# EAGLE design md_ver10.2 (EAGLE 6.4)
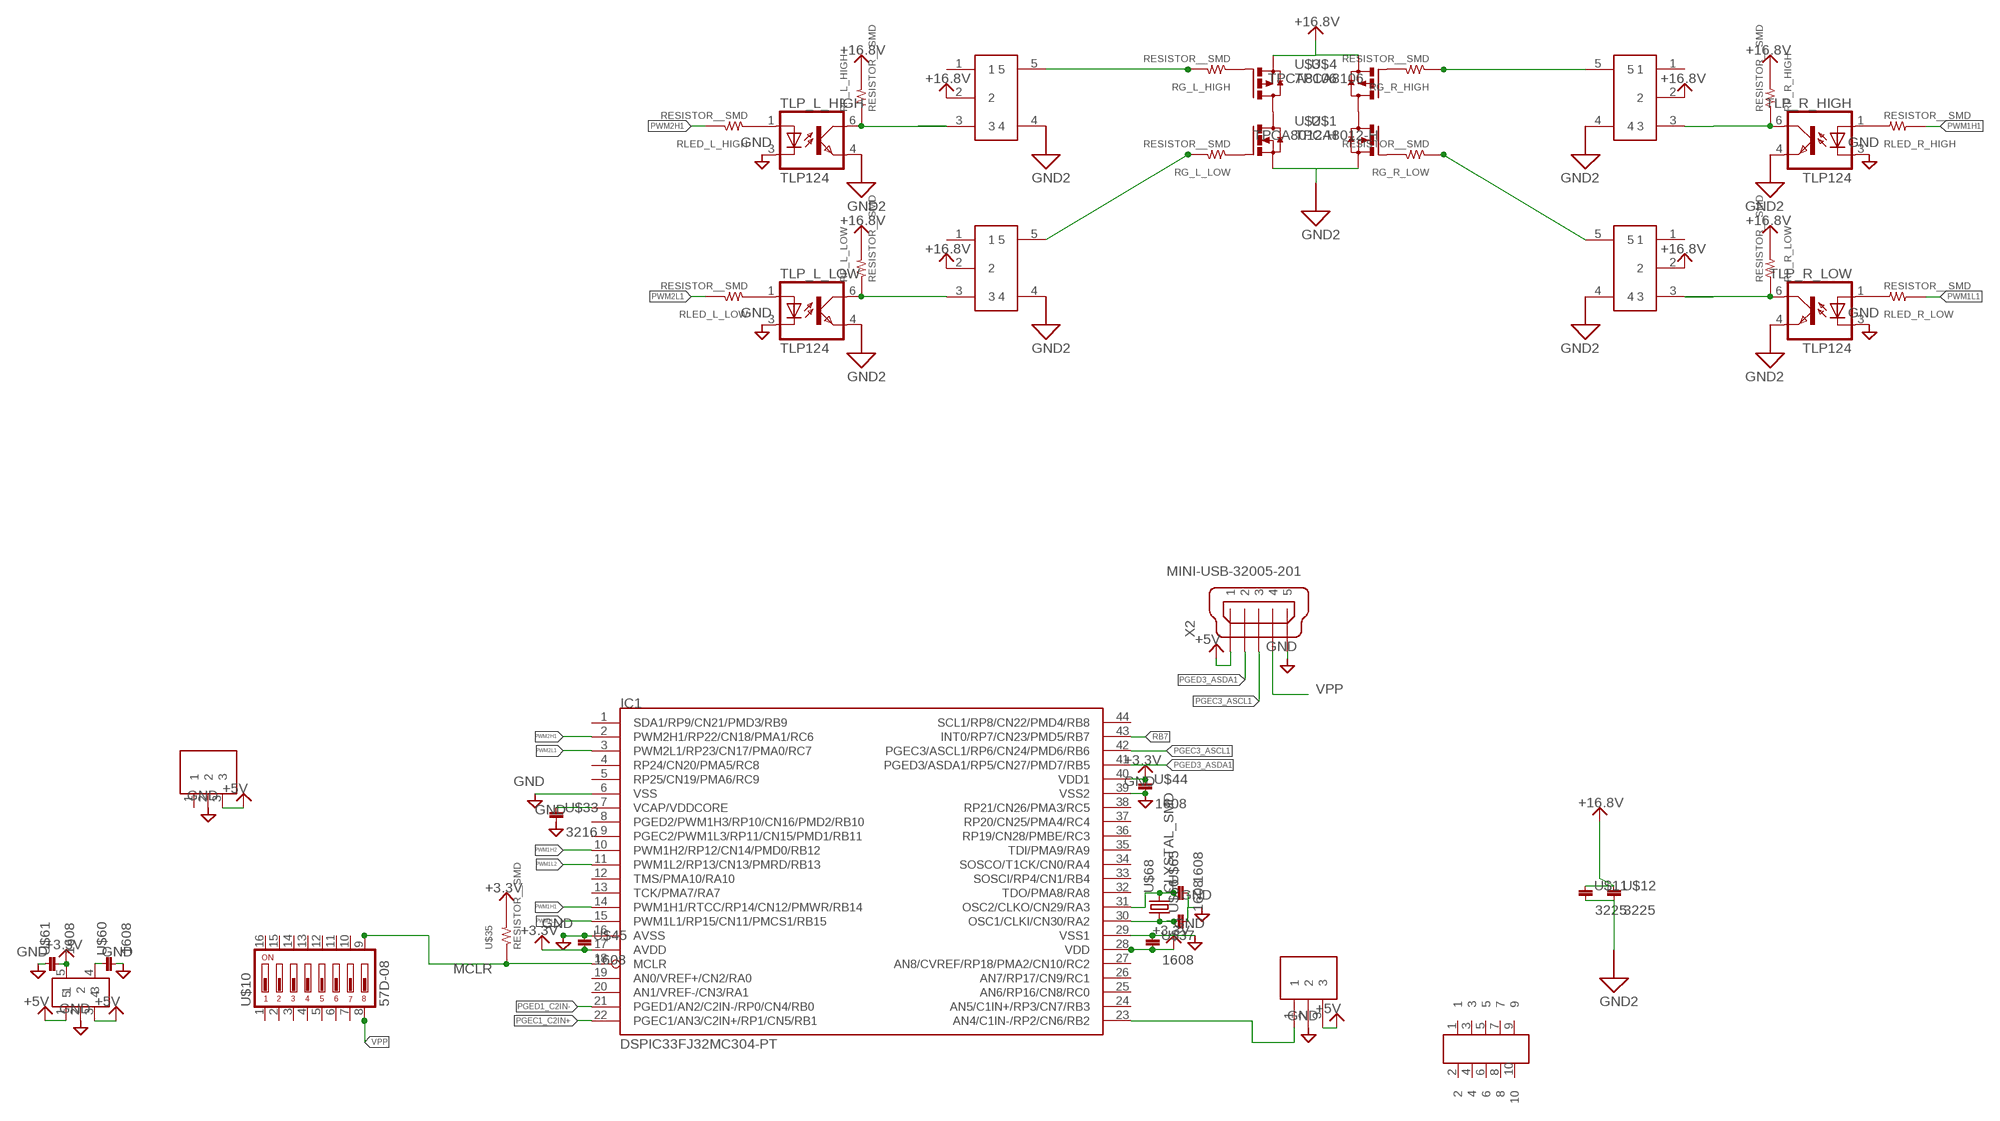
[diagram p0: schematic, sheet 1]

## Parts
IC1  DSPIC33FJ32MC304-PT  [TQFP44]
IC_L_HIGH  MCP1415  [SOT23-5L]
IC_L_LOW  MCP1415  [SOT23-5L]
IC_R_HIGH  MCP1415  [SOT23-5L]
IC_R_LOW  MCP1415  [SOT23-5L]
RG_L_HIGH  RESISTOR__SMD  [1608]
RG_L_LOW  RESISTOR__SMD  [1608]
RG_R_HIGH  RESISTOR__SMD  [1608]
RG_R_LOW  RESISTOR__SMD  [1608]
RLED_L_HIGH  RESISTOR__SMD  [1608]
RLED_L_LOW  RESISTOR__SMD  [1608]
RLED_R_HIGH  RESISTOR__SMD  [1608]
RLED_R_LOW  RESISTOR__SMD  [1608]
RP_L_HIGH  RESISTOR__SMD  [1608]
RP_L_LOW  RESISTOR__SMD  [1608]
RP_R_HIGH  RESISTOR__SMD  [1608]
RP_R_LOW  RESISTOR__SMD  [1608]
TLP_L_HIGH  TLP124  [11−4C1]
TLP_L_LOW  TLP124  [11−4C1]
TLP_R_HIGH  TLP124  [11−4C1]
TLP_R_LOW  TLP124  [11−4C1]
U$1  TPCA8012-H  [2-5Q1A]
U$2  TPCA8012-H  [2-5Q1A]
U$3  TPCA8106  [2-5Q1A]
U$4  TPCA8106  [2-5Q1A]
U$7  ＰＬ－ＩＲＭ  [ＰＬ－ＩＲＭ]
U$8  Ｒ－７８Ｅ５．０  [Ｒ－７８Ｅ５．０]
U$9  TAR5SB  [SSOP5-P-0.95]
U$10  57D-08  [57D]
U$11  3225  [3225]
U$12  3225  [3225]
U$15  PIN_HEADER_52  [PIN_HEADER_5*2]
U$33  3216  [3216]
U$35  RESISTOR__SMD  [1608]
U$37  1608  [1608]
U$44  1608  [1608]
U$45  1608  [1608]
U$60  1608  [1608]
U$61  1608  [1608]
U$65  1608  [1608]
U$66  1608  [1608]
U$68  CLYSTAL_SMD  [CRYSTAL_SMD]
X2  MINI-USB-32005-201  [32005-201]

## Nets
+3.3V: IC1.17(AVDD) IC1.28(VDD) IC1.40(VDD1) U$9.5 U$35.2 U$37.P$2 U$44.P$1 U$45.P$2 U$61.P$2
+5V: U$7.3 U$8.3 U$9.1 U$9.3 X2.1
+16.8V: IC_L_HIGH.2 IC_L_LOW.2 IC_R_HIGH.2 IC_R_LOW.2 RP_L_HIGH.2 RP_L_LOW.2 RP_R_HIGH.2 RP_R_LOW.2 U$3.1(S) U$3.2(S) U$3.3(S) U$4.1(S) U$4.2(S) U$4.3(S) U$11.P$1 U$12.P$1
GND: IC1.6(VSS) IC1.16(AVSS) IC1.29(VSS1) IC1.39(VSS2) TLP_L_HIGH.3(C) TLP_L_LOW.3(C) TLP_R_HIGH.3(C) TLP_R_LOW.3(C) U$7.2 U$8.2 U$9.2 U$33.P$2 U$37.P$1 U$44.P$2 U$45.P$1 U$60.P$2 U$61.P$1 U$65.P$2 U$66.P$2 X2.5
GND2: IC_L_HIGH.4 IC_L_LOW.4 IC_R_HIGH.4 IC_R_LOW.4 TLP_L_HIGH.4(EMIT) TLP_L_LOW.4(EMIT) TLP_R_HIGH.4(EMIT) TLP_R_LOW.4(EMIT) U$1.1(S) U$1.2(S) U$1.3(S) U$2.1(S) U$2.2(S) U$2.3(S) U$11.P$2 U$12.P$2
M1: U$2.5(D) U$2.6(D) U$2.7(D) U$2.8(D) U$3.5(D) U$3.6(D) U$3.7(D) U$3.8(D)
M2: U$1.5(D) U$1.6(D) U$1.7(D) U$1.8(D) U$4.5(D) U$4.6(D) U$4.7(D) U$4.8(D)
MCLR: IC1.18(MCLR) U$10.9 U$35.1
N$1: RG_L_LOW.1 U$2.4(G)
N$2: U$9.4 U$60.P$1
N$3: RLED_L_LOW.1 TLP_L_LOW.1(A)
N$4: RG_R_LOW.2 U$1.4(G)
N$5: IC_L_LOW.5 RG_L_LOW.2
N$6: IC_L_LOW.3 RP_L_LOW.1 TLP_L_LOW.6(COL)
N$7: IC_R_LOW.5 RG_R_LOW.1
N$9: RLED_R_LOW.1 TLP_R_LOW.1(A)
N$11: IC_L_HIGH.3 RP_L_HIGH.1 TLP_L_HIGH.6(COL)
N$12: RLED_L_HIGH.1 TLP_L_HIGH.1(A)
N$14: IC_L_HIGH.5 RG_L_HIGH.2
N$15: IC_R_HIGH.3 RP_R_HIGH.1 TLP_R_HIGH.6(COL)
N$16: RLED_R_HIGH.1 TLP_R_HIGH.1(A)
N$17: IC1.23(AN4/C1IN-/RP2/CN6/RB2) U$7.1
N$18: IC_R_HIGH.5 RG_R_HIGH.1
N$19: RG_L_HIGH.1 U$3.4(G)
N$20: RG_R_HIGH.2 U$4.4(G)
N$22: IC1.30(OSC1/CLKI/CN30/RA2) U$66.P$1 U$68.1
N$23: IC1.31(OSC2/CLKO/CN29/RA3) U$65.P$1 U$68.2
PGEC1_C2IN+: IC1.22(PGEC1/AN3/C2IN+/RP1/CN5/RB1)
PGEC3_ASCL1: IC1.42(PGEC3/ASCL1/RP6/CN24/PMD6/RB6) X2.3
PGED1_C2IN-: IC1.21(PGED1/AN2/C2IN-/RP0/CN4/RB0)
PGED3_ASDA1: IC1.41(PGED3/ASDA1/RP5/CN27/PMD7/RB5) X2.2
PWM1H1: IC1.14(PWM1H1/RTCC/RP14/CN12/PMWR/RB14) RLED_R_HIGH.2
PWM1H2: IC1.10(PWM1H2/RP12/CN14/PMD0/RB12)
PWM1L1: IC1.15(PWM1L1/RP15/CN11/PMCS1/RB15) RLED_R_LOW.2
PWM1L2: IC1.11(PWM1L2/RP13/CN13/PMRD/RB13)
PWM2H1: IC1.2(PWM2H1/RP22/CN18/PMA1/RC6) RLED_L_HIGH.2
PWM2L1: IC1.3(PWM2L1/RP23/CN17/PMA0/RC7) RLED_L_LOW.2
RB7: IC1.43(INT0/RP7/CN23/PMD5/RB7)
TLP_R_LOW: IC_R_LOW.3 RP_R_LOW.1 TLP_R_LOW.6(COL)
VCAP/VDDCORE: IC1.7(VCAP/VDDCORE) U$33.P$1
VPP: U$10.8 X2.4
Unconnected: IC1.1(SDA1/RP9/CN21/PMD3/RB9) IC1.4(RP24/CN20/PMA5/RC8) IC1.5(RP25/CN19/PMA6/RC9) IC1.8(PGED2/PWM1H3/RP10/CN16/PMD2/RB10) IC1.9(PGEC2/PWM1L3/RP11/CN15/PMD1/RB11) IC1.12(TMS/PMA10/RA10) IC1.13(TCK/PMA7/RA7) IC1.19(AN0/VREF+/CN2/RA0) IC1.20(AN1/VREF-/CN3/RA1) IC1.24(AN5/C1IN+/RP3/CN7/RB3) IC1.25(AN6/RP16/CN8/RC0) IC1.26(AN7/RP17/CN9/RC1) IC1.27(AN8/CVREF/RP18/PMA2/CN10/RC2) IC1.32(TDO/PMA8/RA8) IC1.33(SOSCI/RP4/CN1/RB4) IC1.34(SOSCO/T1CK/CN0/RA4) IC1.35(TDI/PMA9/RA9) IC1.36(RP19/CN28/PMBE/RC3) IC1.37(RP20/CN25/PMA4/RC4) IC1.38(RP21/CN26/PMA3/RC5) IC1.44(SCL1/RP8/CN22/PMD4/RB8) IC_L_HIGH.1 IC_L_LOW.1 IC_R_HIGH.1 IC_R_LOW.1 U$8.1 U$10.1 U$10.2 U$10.3 U$10.4 U$10.5 U$10.6 U$10.7 U$10.10 U$10.11 U$10.12 U$10.13 U$10.14 U$10.15 U$10.16 U$15.1 U$15.2 U$15.3 U$15.4 U$15.5 U$15.6 U$15.7 U$15.8 U$15.9 U$15.10

## Library data of the parts
IC1 = microchip-dspic33fjxxmc:DSPIC33FJ32MC304: dsPIC33FJ32MC302/304, dsPIC33FJ64MCX02/X04, AND dsPIC33FJ128MCX02/X04 High-Performance, 16-bit Digital Signal Controllers Operating Range: * Up to 40 MIPS operation (at 3.0V -3.6V): - Industrial temperature range (-40°C to +85°C) - Extended temperature range (-40°C to +125°C) High-Performance DSC CPU: * Modified Harvard architecture * C compiler optimized instruction set * 16-bit wide data path * 24-bit wide instructions * Linear program memory addressing up to 4M instruction words * Linear data memory addressing up to 64 Kbytes * 83 base instructions: mostly 1 word/1 cycle * Two 40-bit accumulators with rounding and saturation options * Flexible and powerful addressing modes: - Indirect - Modulo - Bit-Reversed * Software stack * 16 x 16 fractional/integer multiply operations * 32/16 and 16/16 divide operations * Single-cycle multiply and accumulate: - Accumulator write back for DSP operations - Dual data fetch * Up to ±16-bit shifts for up to 40-bit data Direct Memory Access (DMA): * 8-channel hardware DMA * Up to 2 Kbytes dual ported DMA buffer area (DMA RAM) to store data transferred via DMA: - Allows data transfer between RAM and a peripheral while CPU is executing code (no cycle stealing) * Most peripherals support DMA Timers/Capture/Compare/PWM: * Timer/Counters, up to five 16-bit timers: - Can pair up to make two 32-bit timers - One timer runs as a Real-Time Clock with an external 32.768 kHz oscillator - Programmable prescaler * Input Capture (up to four channels): - Capture on up, down or both edges - 16-bit capture input functions - 4-deep FIFO on each capture * Output Compare (up to four channels): - Single or Dual 16-bit Compare mode - 16-bit Glitchless PWM mode * Hardware Real-Time Clock/Calendar (RTCC): - Provides clock, calendar, and alarm functions Interrupt Controller: * 5-cycle latency * Up to 53 available interrupt sources * Up to three external interrupts * Seven programmable priority levels * Five processor exceptions Digital I/O: * Peripheral pin Select functionality * Up to 35 programmable digital I/O pins * Wake-up/Interrupt-on-Change for up to 31 pins * Output pins can drive from 3.0V to 3.6V * Up to 5V output with open drain configuration * All digital input pins are 5V tolerant * 4 mA sink on all I/O pins On-Chip Flash and SRAM: * Flash program memory (up to 128 Kbytes) * Data SRAM (up to 16 Kbytes) * Boot, Secure, and General Security for program Flash System Management: * Flexible clock options: - External, crystal, resonator, internal RC - Fully integrated Phase-Locked Loop (PLL) - Extremely low jitter PLL * Power-up Timer * Oscillator Start-up Timer/Stabilizer * Watchdog Timer with its own RC oscillator * Fail-Safe Clock Monitor * Reset by multiple sources Power Management: * On-chip 2.5V voltage regulator * Switch between clock sources in real time * Idle, Sleep, and Doze modes with fast wake-up Analog-to-Digital Converters (ADCs): * 10-bit, 1.1 Msps or 12-bit, 500 Ksps conversion: - Two and four simultaneous samples (10-bit ADC) - Up to nine input channels with auto-scanning - Conversion start can be manual or synchronized with one of four trigger sources - Conversion possible in Sleep mode - ±2 LSb max integral nonlinearity - ±1 LSb max differential nonlinearity Audio Digital-to-Analog Converter (DAC): - 16-bit Dual Channel DAC module - 100 Ksps maximum sampling rate - Second-Order Digital Delta-Sigma Modulator Comparator Module: * Two analog comparators with programmable input/output configuration CMOS Flash Technology: * Low-power, high-speed Flash technology * Fully static design * 3.3V (±10%) operating voltage * Industrial and Extended temperature * Low power consumption Motor Control Peripherals: * 6-channel 16-bit Motor Control PWM: - Three duty cycle generators - Independent or Complementary mode - Programmable dead-time and output polarity - Edge-aligned or center-aligned - Manual output override control - One Fault input - Trigger for ADC conversions - PWM frequency for 16-bit resolution (@ 40 MIPS) = 1220 Hz for Edge-Aligned mode, 610 Hz for Center-Aligned mode - PWM frequency for 11-bit resolution (@ 40 MIPS) = 39.1 kHz for Edge-Aligned mode, 19.55 kHz for Center-Aligned mode * 2-channel 16-bit Motor Control PWM: - One duty cycle generator - Independent or Complementary mode - Programmable dead time and output polarity - Edge-aligned or center-aligned - Manual output override control - One Fault input - Trigger for ADC conversions - PWM frequency for 16-bit resolution (@ 40 MIPS) = 1220 Hz for Edge-Aligned mode, 610 Hz for Center-Aligned mode - PWM frequency for 11-bit resolution (@ 40 MIPS) = 39.1 kHz for Edge-Aligned mode, 19.55 kHz for Center-Aligned mode * 2-Quadrature Encoder Interface module: - Phase A, Phase B, and index pulse input - 16-bit up/down position counter - Count direction status - Position Measurement (x2 and x4) mode - Programmable digital noise filters on inputs - Alternate 16-bit Timer/Counter mode - Interrupt on position counter rollover/underflow
IC_L_HIGH IC_L_LOW IC_R_HIGH IC_R_LOW = 04_IC:MCP1415
RG_L_HIGH RG_L_LOW RG_R_HIGH RG_R_LOW RLED_L_HIGH RLED_L_LOW RLED_R_HIGH RLED_R_LOW RP_L_HIGH RP_L_LOW RP_R_HIGH RP_R_LOW U$35 = 01_R:RESISTOR__SMD
TLP_L_HIGH TLP_L_LOW TLP_R_HIGH TLP_R_LOW = 04_IC:TLP124
U$1 U$2 = 06_FET:TPCA8012-H
U$3 U$4 = 06_FET:TPCA8106
U$7 = 04_IC:ＰＬ－ＩＲＭ
U$8 = 04_IC:Ｒ－７８Ｅ５．０
U$9 = 04_IC:TAR5SB
U$10 = switch:57D-08
U$11 U$12 = 02_C:3225
U$15 = 08_CONECTOR:PIN_HEADER_5*2
U$33 = 02_C:3216
U$37 U$44 U$45 U$60 U$61 U$65 U$66 = 02_C:1608
U$68 = CRYSTAL:CLYSTAL_SMD
X2 = con-cypressindustries:MINI-USB-: MINI USB-B Conector Source: www.cypressindustries.com; OC_FARNELL: unknown; OC_NEWARK: unknown

## Board
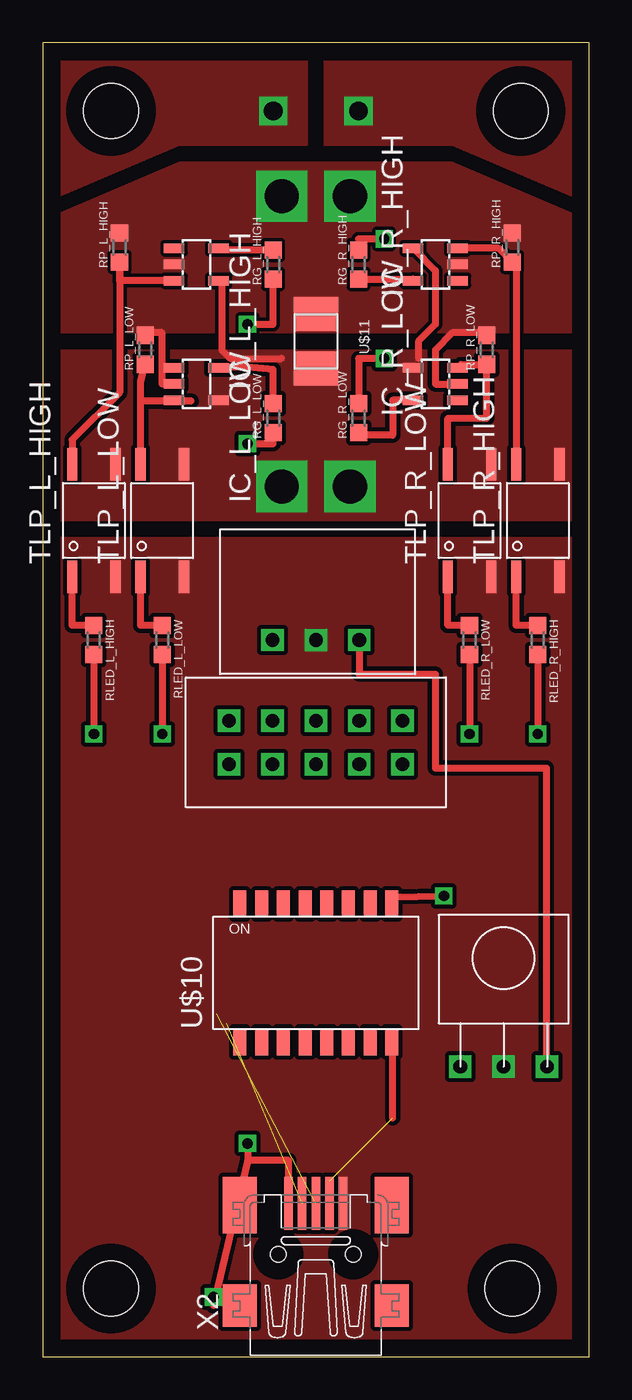
[diagram p1: board, top side]
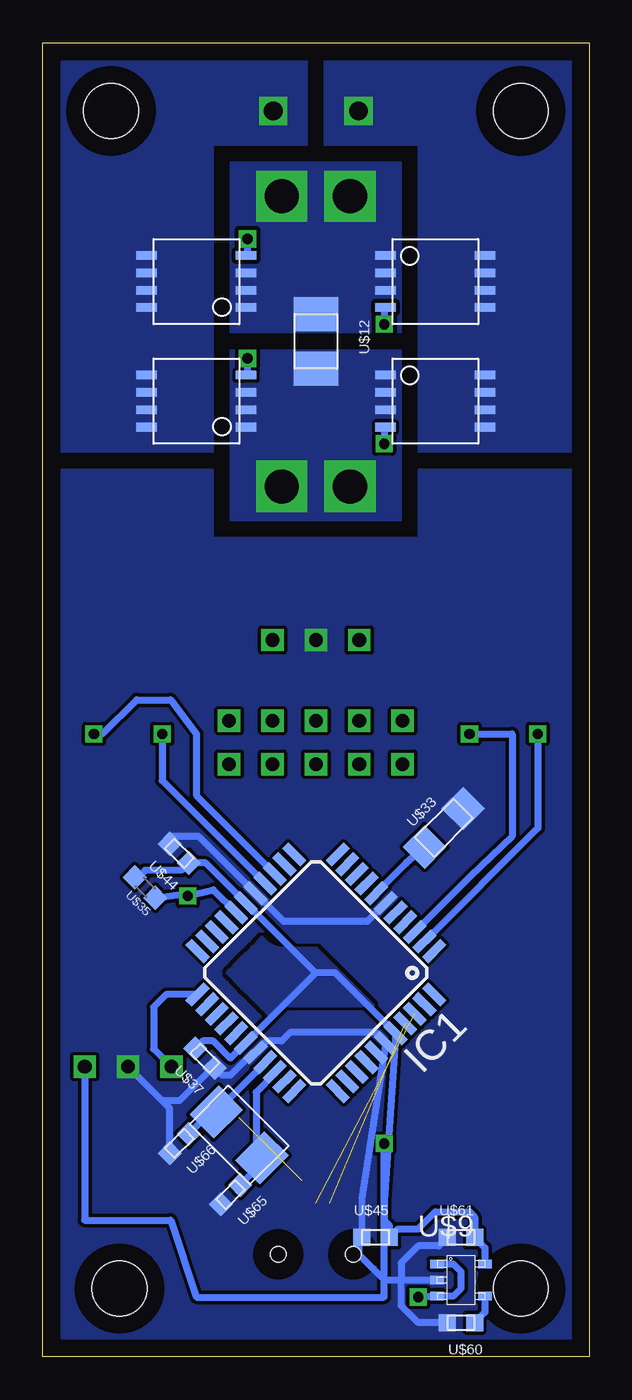
[diagram p2: board, bottom side, seen from below]

Size 32 x 77 mm. Coordinates in mm from the lower left corner, seen from the top.
Outline: 0,0 32,0 32,77 0,77 0,0
Copper layers (1*16): Top 0.035mm / dielectric 1.5mm / Bottom 0.035mm
Design rules "default": minimum track width 10mil, minimum drill 24mil, track to track 8mil, track to pad 8mil, pad to pad 8mil, via to via 8mil, smd to smd 8mil, copper to edge 40mil, drill to drill 8mil, minimum pad ring 10mil, minimum via ring 8mil, stop-mask expansion 4mil, vias tented up to drill 0mil, thermal gap 10mil
Holes 3.2 mm at 4,4 27.5,4 4,73 28,73

### Footprints (pad centres in the part's own frame; a part is rotated, then mirrored left to right if it is on the bottom)
TQFP44 = smd 1.5 x 0.5: 1 -5.8,4; 2 -5.8,3.2; 3 -5.8,2.4; 4 -5.8,1.6; 5 -5.8,0.8; 6 -5.8,0; 7 -5.8,-0.8; 8 -5.8,-1.6; 9 -5.8,-2.4; 10 -5.8,-3.2; 11 -5.8,-4; 23 5.8,-4; 24 5.8,-3.2; 25 5.8,-2.4; 26 5.8,-1.6; 27 5.8,-0.8; 28 5.8,0; 29 5.8,0.8; 30 5.8,1.6; 31 5.8,2.4; 32 5.8,3.2; 33 5.8,4 | smd 0.5 x 1.5: 12 -4,-5.8; 13 -3.2,-5.8; 14 -2.4,-5.8; 15 -1.6,-5.8; 16 -0.8,-5.8; 17 0,-5.8; 18 0.8,-5.8; 19 1.6,-5.8; 20 2.4,-5.8; 21 3.2,-5.8; 22 4,-5.8; 34 4,5.8; 35 3.2,5.8; 36 2.4,5.8; 37 1.6,5.8; 38 0.8,5.8; 39 0,5.8; 40 -0.8,5.8; 41 -1.6,5.8; 42 -2.4,5.8; 43 -3.2,5.8; 44 -4,5.8
SOT23-5L = smd 0.55 x 1.2: 1 -0.95,-1.3; 2 0,-1.3; 3 0.95,-1.3; 4 0.95,1.3; 5 -0.95,1.3
1608 = smd 1 x 1: 1 -0.85,0; 2 0.85,0
11−4C1 = smd 0.6 x 1.9: 1 -1.27,-3.3; 3 1.27,-3.3; 4 1.27,3.3; 6 -1.27,3.3
2-5Q1A = smd 0.5 x 1.2: 1 -1.524,-2.921; 2 -0.508,-2.921; 3 0.508,-2.921; 4 1.524,-2.921; 5 1.524,2.921; 6 0.508,2.921; 7 -0.508,2.921; 8 -1.524,2.921
ＰＬ－ＩＲＭ = drill 0.8 square: 1 -2.54,0; 2 0,0; 3 2.54,0
Ｒ－７８Ｅ５．０ = drill 0.8 square: 1 -2.54,0; 2 0,0; 3 2.54,0
SSOP5-P-0.95 = smd 0.5 x 0.8: 1 -0.95,-1.4; 2 0,-1.4; 3 0.95,-1.4; 4 0.95,1.4; 5 -0.95,1.4
57D = smd 0.76 x 1.58: 1 -4.445,-4.045; 2 -3.175,-4.045; 3 -1.905,-4.045; 4 -0.635,-4.045; 5 0.635,-4.045; 6 1.905,-4.045; 7 3.175,-4.045; 8 4.445,-4.045; 9 4.445,4.045; 10 3.175,4.045; 11 1.905,4.045; 12 0.635,4.045; 13 -0.635,4.045; 14 -1.905,4.045; 15 -3.175,4.045; 16 -4.445,4.045
3225 = smd 2 x 2.6: P$1 -1.6,0; P$2 1.6,0
PIN_HEADER_5*2 = drill 0.8 square: 1 -5.08,1.27; 2 -5.08,-1.27; 3 -2.54,1.27; 4 -2.54,-1.27; 5 0,1.27; 6 0,-1.27; 7 2.54,1.27; 8 2.54,-1.27; 9 5.08,1.27; 10 5.08,-1.27
3216 = smd 1.8 x 1.8: P$1 -1.6,0; P$2 1.6,0
1608' = smd 1 x 1: P$1 -0.8,0; P$2 0.8,0
CRYSTAL_SMD = smd 2 x 2.4: 1 -1.9,0; 2 1.9,0
32005-201 = smd 3.1 x 0.5: 1 3,1.6; 2 3,0.8; 3 3,0; 4 3,-0.8; 5 3,-1.6 | smd 2.5 x 2: M1 -3,-4.45; M2 -3,4.45 | smd 3.3 x 2: M3 2.9,4.45; M4 2.9,-4.45 | hole 0.9: 0,2.2; 0,-2.2

### Placement (x,y rotation side)
IC1  16,22.5 225 bottom
IC_L_HIGH  9,64 270 top
IC_L_LOW  9,57 270 top
IC_R_HIGH  23,64 90 top
IC_R_LOW  23,57 90 top
RG_L_HIGH  13.5,64 90 top
RG_L_LOW  13.5,55 90 top
RG_R_HIGH  18.5,64 90 top
RG_R_LOW  18.5,55 90 top
RLED_L_HIGH  3,42 270 top
RLED_L_LOW  7,42 270 top
RLED_R_HIGH  29,42 270 top
RLED_R_LOW  25,42 270 top
RP_L_HIGH  4.5,65 90 top
RP_L_LOW  6,59 90 top
RP_R_HIGH  27.5,65 90 top
RP_R_LOW  26,59 90 top
TLP_L_HIGH  3,49 0 top
TLP_L_LOW  7,49 0 top
TLP_R_HIGH  29,49 0 top
TLP_R_LOW  25,49 0 top
U$1  23,56 90 bottom
U$2  9,56 270 bottom
U$3  9,63 270 bottom
U$4  23,63 90 bottom
U$7  27,17 0 top
U$8  16,42 0 top
U$9  7.5,4.5 270 bottom
U$10  16,22.5 0 top
U$11  16,59.5 270 top
U$12  16,59.5 270 bottom
U$15  16,36 0 top
U$33  8.5,31 45 bottom
U$35  26,27.5 135 bottom
U$37  1608  [1608']  22.5,17.5 135 bottom
U$44  1608  [1608']  24,29.5 135 bottom
U$45  1608  [1608']  12.5,7 0 bottom
U$60  1608  [1608']  7.5,2 180 bottom
U$61  1608  [1608']  7.5,7 0 bottom
U$65  1608  [1608']  21,9.5 225 bottom
U$66  1608  [1608']  24,12.5 225 bottom
U$68  20.5,13 315 bottom
X2  16,6 90 top

### Tracks (layer width: path | path; a pad name or v marks a point on that pad's centre or on a via)
+3.3V
  Bottom 0.406: 16,22.5 14.87,22.5 IC1.40 12,9.13 12,8 11.7,7.7 U$45.P$2 11.2,7.5 10,7.5 9,8.5 7,8.5 6.7,8.2 U$61.P$2 6.1,6.4 U$9.5 | 16,22.5 IC1.17 | IC1.17 | 16,22.5 IC1.28 21,17.5 22,18.5 22.63,18.5 U$37.P$2 | IC1.17 22.43,28.93 U$44.P$1 23.87,28.5 26,28.5 26.4,28.1 U$35.2
  pour Bottom (isolate 1.27, no thermals): 12.5,20.5 18,26 21.5,22.5 18.5,19.5 14.5,20.5
+5V  (via drill 0.6)
  Top 0.406: X2.1 14.4,11.5 12,11.5 | 12,11.5 10,3 v10,3.5 | U$8.3 18.54,40 23,40 23,34.5 29.5,34.5 29.5,17 U$7.3 | v12,12.5 12,11.5
  Bottom 0.406: U$9.1 7.95,5.45 7.5,5 7.5,4 7.95,3.55 U$9.3 10,3.55 v10,3.5 | U$7.3 29.54,8 24.5,8 23,3.5 12,3.5 v12,12.5
+16.8V  (via drill 2)
  Top 0.4: IC_L_LOW.2 7,57 7,60 6,60 RP_L_LOW.2
  Top 0.406: RP_R_LOW.2 25.85,60 24,60 23,59 23,57 IC_R_LOW.2
  other vias: 18,68 14,68
  pour Bottom (isolate 0.254, rank 2, no thermals): 11,70 21,70 21,60 11,60
  pour Top (no thermals): 1,60 31,60 31,67 24,70 8,70 1,67
GND
  Bottom 0.406: U$44.P$2 24.57,30.43 24.5,30.5 22.87,30.5 IC1.16 17.87,25.5 13,25.5 IC1.6 | 25,15 24,15 22.07,16.93 U$37.P$1 21.5,16.5 21,16.5 19.67,17.83 IC1.29 18.87,18.5 18,18.5 17.5,19 12.5,19 IC1.39 13.3,9.3 U$45.P$1 13.5,6.8 13.5,6 12,4.5 11,4.5 | 25,15 U$7.2 | U$66.P$2 24.57,14.57 25,15 | U$60.P$2 10,2 11,3 11,4.5 | 11,4.5 U$9.2 | U$61.P$1 8.8,6.5 10,6.5 11,5.5 11,4.5
  pour Top (isolate 0.254, no thermals): 1,48 31,48 31,1 1,1
  pour Bottom (rank 2, no thermals): 1,52 10,52 10,48 22,48 22,52 31,52 31,1 1,1
GND2  (via drill 2)
  Top 0.406: IC_R_HIGH.4 23,63.65 23,60.5 22,59.5 22,58.5 | IC_L_HIGH.4 10.5,62.85 10.5,59 11,58.5 14,58.5
  other vias: 18,51 14,51
  pour Bottom (isolate 0.1, no thermals): 11,49 11,59 21,59 21,49
  pour Top (isolate 0.254, no thermals): 1,59 31,59 31,49 1,49
M1  (via drill 1.1)
  other vias: 13.5,73
  pour Bottom (isolate 0.254, no thermals): 1,76 15.5,76 15.5,71 10,71 10,53 1,53
  pour Top (no thermals): 1,76 15.5,76 15.5,71 8,71 1,68
M2  (via drill 1.1)
  other vias: 18.5,73
  pour Bottom (isolate 0.254, no thermals): 22,53 22,71 16.5,71 16.5,76 31,76 31,53
  pour Top (no thermals): 16.5,76 31,76 31,68 24,71 16.5,71
MCLR  (via drill 0.6)
  Top 0.406: U$10.9 20.45,26.95 v23.5,27
  Bottom 0.406: IC1.18 22,27.37 v23.5,27 23.9,27.1 U$35.1
N$1  (via drill 0.6)
  Top 0.406: v12,53.5 13.5,53.5 RG_L_LOW.1
  Bottom 0.406: U$2.4 12,54.48 v12,53.5
N$2
  Bottom 0.406: U$9.4 6.1,2.6 U$60.P$1
N$3
  Top 0.4: RLED_L_LOW.1 5.73,42.85 TLP_L_LOW.1
N$4  (via drill 0.6)
  Top 0.406: v20,58.5 18.5,58.5 RG_R_LOW.2
  Bottom 0.406: U$1.4 20,57.52 v20,58.5
N$5
  Top 0.406: RG_L_LOW.2 13.5,57.85 12,58 10.3,58 IC_L_LOW.5
N$6
  Top 0.4: TLP_L_LOW.6 5.73,56 | 5.73,56 5.73,57.15 RP_L_LOW.1 | IC_L_LOW.3 8.7,56 5.73,56
N$7
  Top 0.406: IC_R_LOW.5 20.5,56.05 20.5,54 18.5,54 RG_R_LOW.1
N$8  (via drill 0.6)
  other vias: 20,65.5
N$9
  Top 0.4: RLED_R_LOW.1 23.73,42.85 TLP_R_LOW.1
N$10  (via drill 0.6)
  other vias: 20,58.5
N$11
  Top 0.406: IC_L_HIGH.3 4.5,63.05 RP_L_HIGH.1 4.5,56.5 1.73,53.73 TLP_L_HIGH.6
N$12
  Top 0.4: RLED_L_HIGH.1 1.73,42.85 TLP_L_HIGH.1
N$13  (via drill 0.6)
  other vias: 12,53.5
N$14
  Top 0.406: RG_L_HIGH.2 10.3,64.85 IC_L_HIGH.5
N$15
  Top 0.406: IC_R_HIGH.3 26.7,64.95 RP_R_HIGH.1 27.73,63.92 TLP_R_HIGH.6
N$16
  Top 0.4: RLED_R_HIGH.1 27.73,42.85 TLP_R_HIGH.1
N$17
  Bottom 0.406: IC1.23 24.77,21.23 25.5,20.5 25.5,18.04 U$7.1
N$18
  Top 0.406: RG_R_HIGH.1 21.7,63.15 IC_R_HIGH.5
N$19  (via drill 0.6)
  Top 0.406: v12,60.5 13.5,60.5 RG_L_HIGH.1
  Bottom 0.406: U$3.4 12,61.48 v12,60.5
N$20  (via drill 0.6)
  Top 0.406: v20,65.5 18.5,65.5 RG_R_HIGH.2
  Bottom 0.406: U$4.4 20,64.52 v20,65.5
N$22
  Bottom 0.406: IC1.30 18.97,17.22 U$68.1 22.16,14.34 U$66.P$1
N$23
  Bottom 0.406: IC1.31 18.4,16.6 19.5,15.5 19.5,12 U$68.2 19.16,11.34 U$65.P$1
PGEC3_ASCL1  (1 unrouted)
PGED3_ASDA1  (1 unrouted)
PWM1H1  (via drill 0.6)
  Top 0.406: RLED_R_HIGH.2 v29,36.5
  Bottom 0.406: v29,36.5 28.5,36.5 26.5,38.5 24.5,38.5 23,36.5 23,32.89 IC1.14
PWM1L1  (via drill 0.6)
  Top 0.406: RLED_R_LOW.2 v25,36.5
  Bottom 0.406: v25,36.5 25,33.76 IC1.15
PWM2H1  (via drill 0.6)
  Top 0.406: RLED_L_HIGH.2 v3,36.5
  Bottom 0.406: v3,36.5 3,30.98 IC1.2
PWM2L1  (via drill 0.6)
  Top 0.406: RLED_L_LOW.2 v7,36.5
  Bottom 0.406: v7,36.5 4.5,36.5 4.5,30.5 7,28.11 IC1.3
TLP_R_LOW
  Top 0.4: TLP_R_LOW.6 23.73,55 26,55 RP_R_LOW.1
  Top 0.406: IC_R_LOW.3 24.5,58.15 RP_R_LOW.1
VCAP/VDDCORE
  Bottom 0.406: IC1.7 10.73,28.9 U$33.P$1
VPP  (1 unrouted)
  Top 0.406: X2.4 16.8,10.3 | 20.5,14 20.5,18.4 U$10.8